# EAGLE design particle_photo_relay_board (EAGLE 9.1.2)
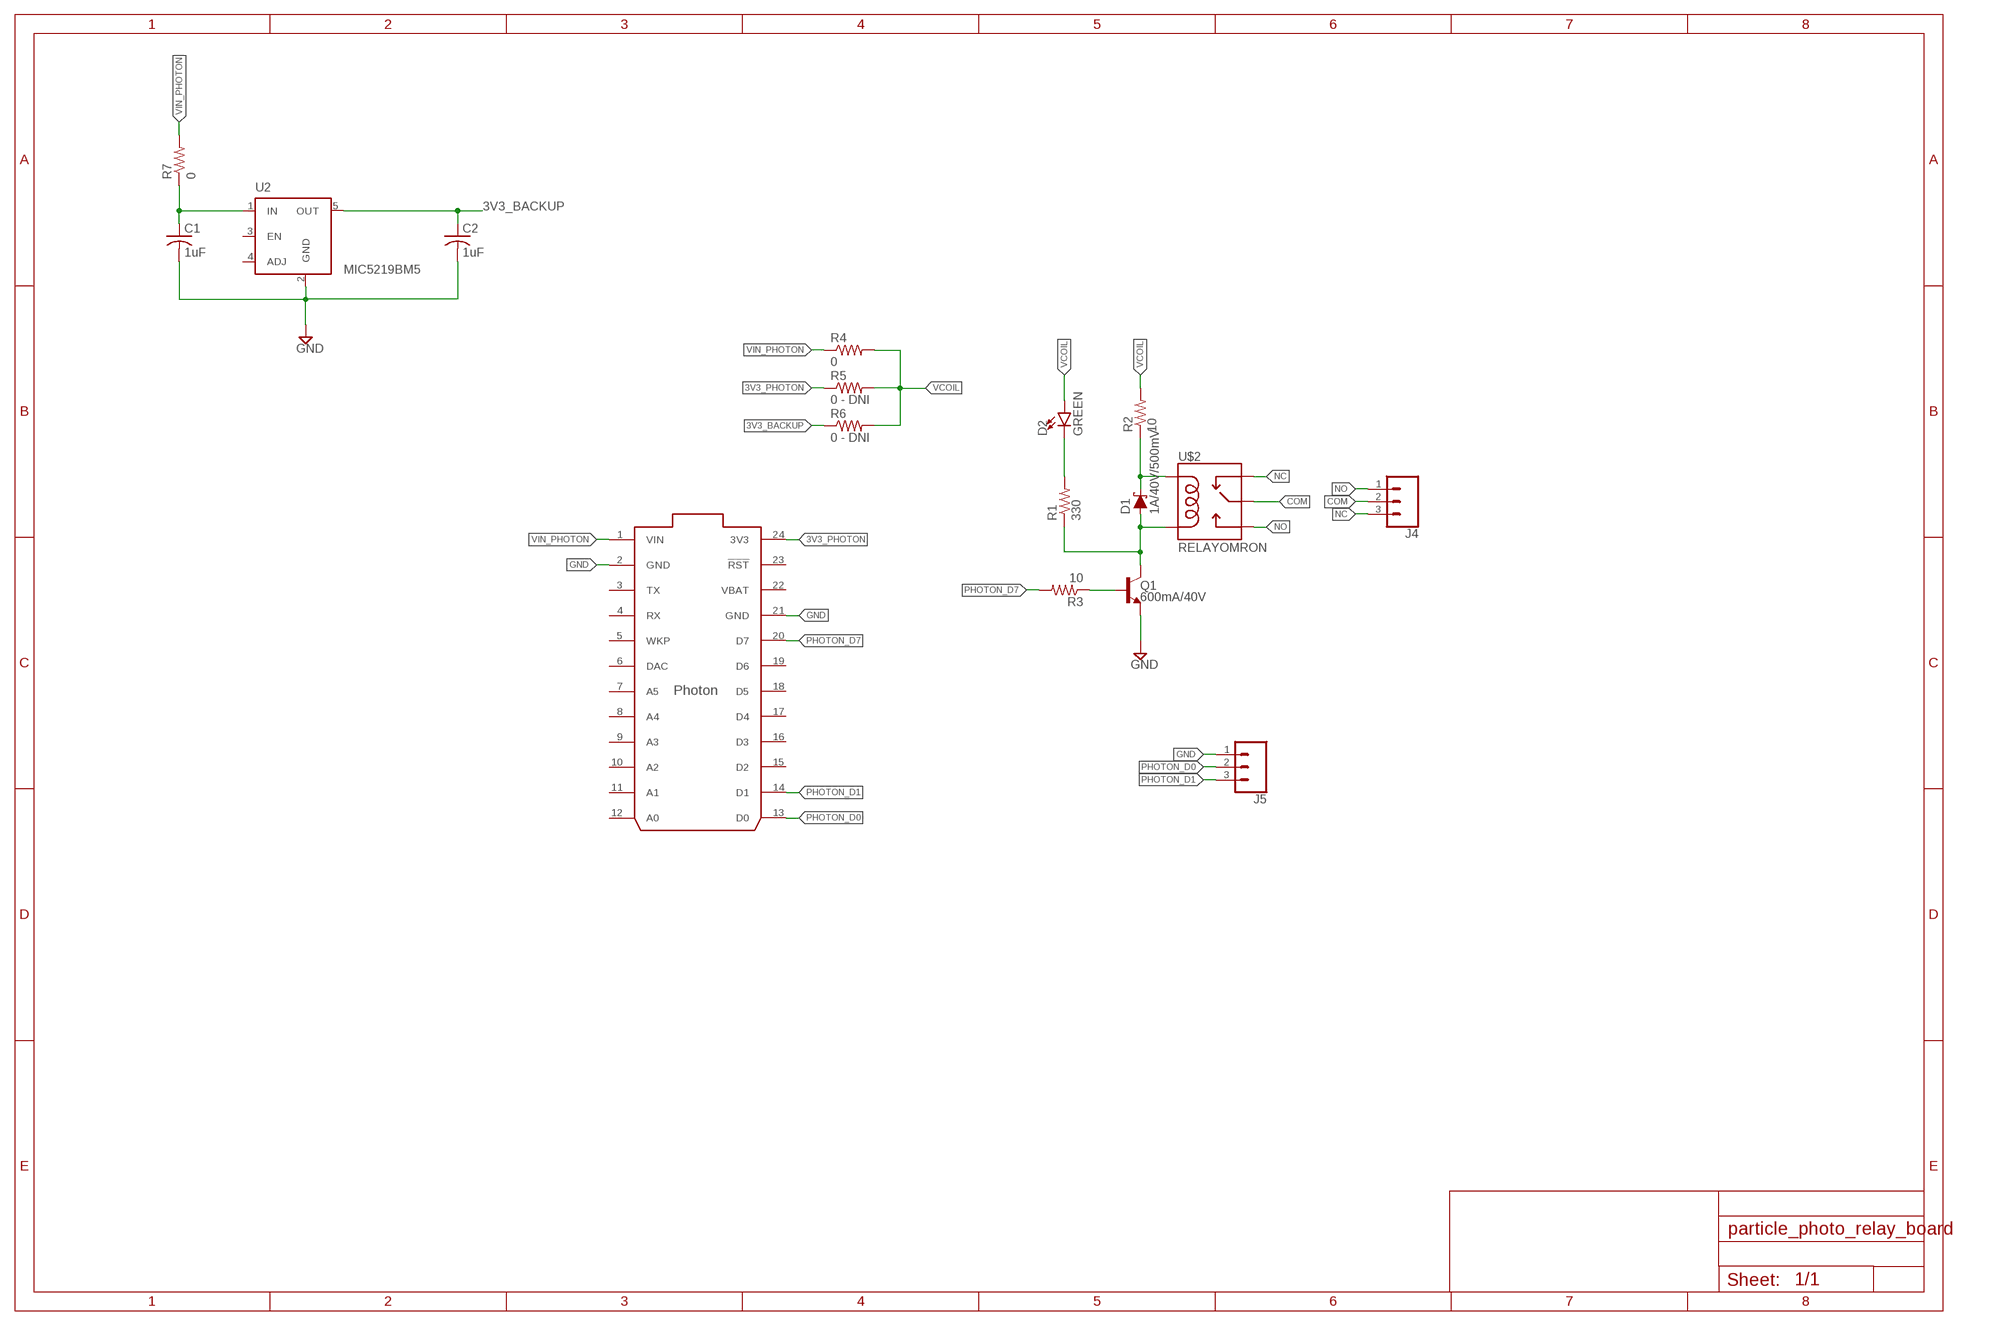
[diagram p0: schematic, sheet 1]

## Parts
C1  1uF  C-USC0805  [C0805]
C2  1uF  C-USC0805  [C0805]
D1  1A/40V/500mV  DIODE-SCHOTTKY-SS14  [SMA-DIODE]
D2  GREEN  LED-GREEN1206  [LED-1206]
J4  CONN_03-SCREW-5MM  [SCREWTERMINAL-5MM-3]
J5  CONN_03-SCREW-5MM  [SCREWTERMINAL-5MM-3]
Q1  600mA/40V  TRANS_NPN-MMBT2222AL  [SOT23-3]
R1  330  R-US_R0805  [R0805]
R2  10  R-US_R0805  [R0805]
R3  10  R-US_R0805  [R0805]
R4  0  R-US_R0805  [R0805]
R5  0 - DNI  R-US_R0805  [R0805]
R6  0 - DNI  R-US_R0805  [R0805]
R7  0  R-US_R0805  [R0805]
U2  MIC5219BM5  [SOT23-5]
U$1  PHOTON_WITH_HEADERS  [PHOTON]
U$2  RELAYOMRON  [G5LE-14-DC5]

## Nets
3V3_BACKUP: C2.1 R6.1 U2.5(OUT)
3V3_PHOTON: R5.1 U$1.24(3V3)
COM: J4.2 U$2.COMMON(MAIN)
GND: C1.2 C2.2 J5.1 Q1.2(E) U2.2(GND) U$1.2(GND) U$1.21(GND)
N$1: D1.A Q1.3(C) R1.1 U$2.COIL2
N$2: D1.C R2.1 U$2.COIL1
N$3: D2.C R1.2
N$4: Q1.1(B) R3.1
NC: J4.3 U$2.CLOSED(NC)
NO: J4.1 U$2.OPEN(NO)
PHOTON_D0: J5.2 U$1.13(D0)
PHOTON_D1: J5.3 U$1.14(D1)
PHOTON_D7: R3.2 U$1.20(D7)
VBUS_BACKUP: C1.1 R7.1 U2.1(IN)
VCOIL: D2.A R2.2 R4.2 R5.2 R6.2
VIN_PHOTON: R4.1 R7.2 U$1.1(VIN)
Unconnected: U2.3(EN) U2.4(ADJ) U$1.3(TX) U$1.4(RX) U$1.5(WKP) U$1.6(DAC) U$1.7(A5) U$1.8(A4) U$1.9(A3) U$1.10(A2) U$1.11(A1) U$1.12(A0) U$1.15(D2) U$1.16(D3) U$1.17(D4) U$1.18(D5) U$1.19(D6) U$1.23(!RST)

## Power pins joined to a net without a drawn wire
VBAT: U$1.22(VBAT)

## Library data of the parts
C1 C2 = rcl:C-US: CAPACITOR, American symbol; SPICEPREFIX: C
D1 = SparkFun-DiscreteSemi:DIODE-SCHOTTKY: Schottky diode A Schottky diode is a semiconductor diode which has a low forward voltage drop and a very fast switching action.; PROD_ID: DIO-08053
D2 = SparkFun-LED:LED-GREEN: Green SMD LED Used in manufacturing of various products at SparkFun Packages: 0603 - SMD 0603 package [Product Link] <http://www.futureelectronics.com/en/technologies/semiconductors/optoelectronics/leds/Pages/9894312-LTST-C190GKT.aspx?CrossPart=HSMG-C190&IM=0> LilyPad 1206 - SMD1206 LilyPad package [Product Link] <http://www.futureelectronics.com/en/Technologies/Product.aspx?ProductID=IN150NGHARVATEKCORPORATION2049943&IM=0> 1206 - SMD1206 package [Product Link] <http://www.futureelectronics.com/en/technologies/semiconductors/optoelectronics/leds/Pages/8315665-LTST-C150KGKT.aspx?IM=0> 1206 Bottom Mount -SMD 1206 Bottom Mount [Product Link] <http://www.digikey.com/product-detail/en/lite-on-inc/LTST-C230KGKT/160-1456-1-ND/386854> SparkFun Products: Pro Mini 328 -5V <https://www.sparkfun.com/products/821> RedBoard <https://www.sparkfun.com/products/12757> MP3 Trigger <https://www.sparkfun.com/products/13720> Makey Makey <https://www.sparkfun.com/products/11076>; PROD_ID: DIO-00862
J4 J5 = SparkFun-Connectors:CONN_03: Multi connection point. Often used as Generic Header-pin footprint for 0.1 inch spaced/style header connections On any of the 0.1 inch spaced packages, you can populate with these: Break Away Headers - Straight <https://www.sparkfun.com/products/116> (PRT-00116) Break Away Male Headers - Right Angle <https://www.sparkfun.com/products/553> (PRT-00553) Female Headers <https://www.sparkfun.com/products/115> (PRT-00115) Break Away Headers - Machine Pin <https://www.sparkfun.com/products/117> (PRT-00117) Break Away Female Headers - Swiss Machine Pin <https://www.sparkfun.com/products/743> (PRT-00743) Stackable Header - 3 Pin (Female, 0.1") <https://www.sparkfun.com/products/13875> (PRT-13875) For SCREWTERMINALS and SPRING TERMINALS visit here: Screw Terimnals on SparkFun.com <https://www.sparkfun.com/search/results?term=Screw+Terminals> (5mm/3.5mm/2.54mm spacing) This device is also useful as a general connection point to wire up your design to another part of your project. Our various solder wires solder well into these plated through hole pads. Hook-Up Wire - Assortment (Stranded, 22 AWG) <https://www.sparkfun.com/products/11375> (PRT-11375) Hook-Up Wire - Assortment (Solid Core, 22 AWG) <https://www.sparkfun.com/products/11367> (PRT-11367) View the entire wire category on our website here <https://www.sparkfun.com/categories/141> Special notes: Molex polarized connector foot print use with SKU : PRT-08232 with associated crimp pins and housings.; PROD_ID: CONN-10134; SF_SKU: PRT-08433
Q1 = SparkFun-DiscreteSemi:TRANS_NPN: NPN transistor Current controlled devices typically used to amplify current or used as a switch. BC547 - COM-08928 <http://www.sparkfun.com/products/8928> (TO-92 45V 100mA) (1.Collector 2.Base 3.Emitter) 2N3904 - COM-00521 <http://www.sparkfun.com/products/521> (TO-92 40V 200mA) (1.Emitter 2.Base 3.Collector) P2N2222A - COM-12852 <http://www.sparkfun.com/products/12852> (TO-92 40V 600mA) (1.Collector 2.Base 3.Emitter); PROD_ID: TRANS-08049
R1-R7 = rcl:R-US_: RESISTOR, American symbol; SPICEPREFIX: R
U2 = v-reg-micrel:MIC5219BM5: VOLTAGE REGULATOR; MF: ALTERA CORPORATION; MPN: MIC5219BM5 TR; OC_FARNELL: 1100656; OC_NEWARK: 09J8939
U$1 = Particle-Devices:PHOTON: Particle Photon Wi-Fi through-hole development board footprint Product datasheet: here <https://docs.particle.io/datasheets/photon-(wifi)/photon-datasheet/> Design files: here <https://github.com/particle-iot/photon> Github : Particle devices library <https://github.com/particle-iot/hardware-libraries/tree/master/Eagle>
U$2 = Particle:RELAY: SPDT relay (COM-00101)

## Board
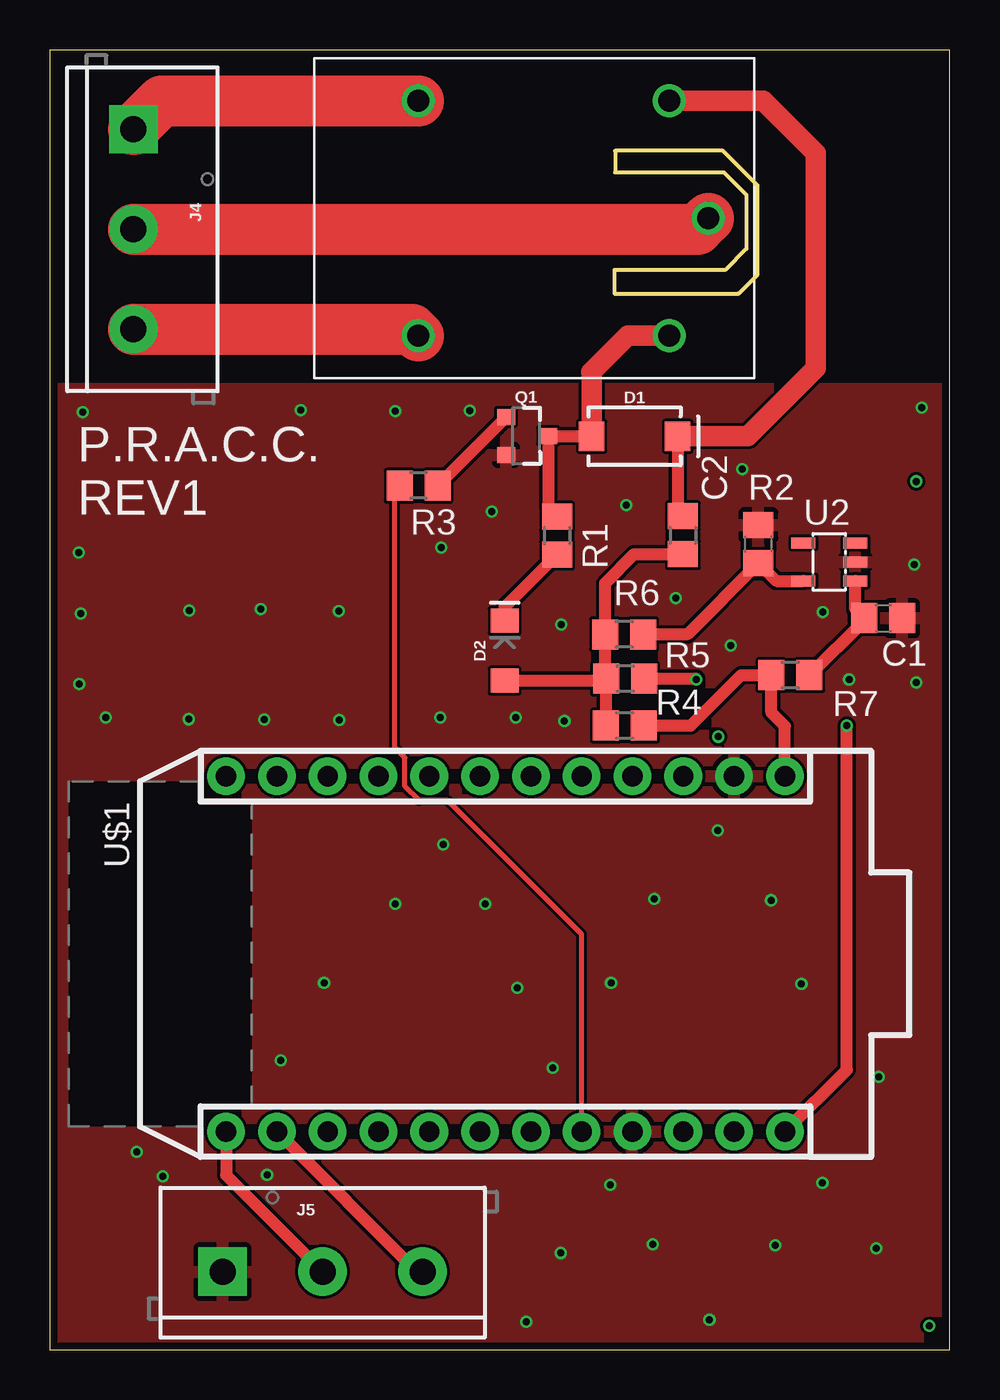
[diagram p1: board, top side]
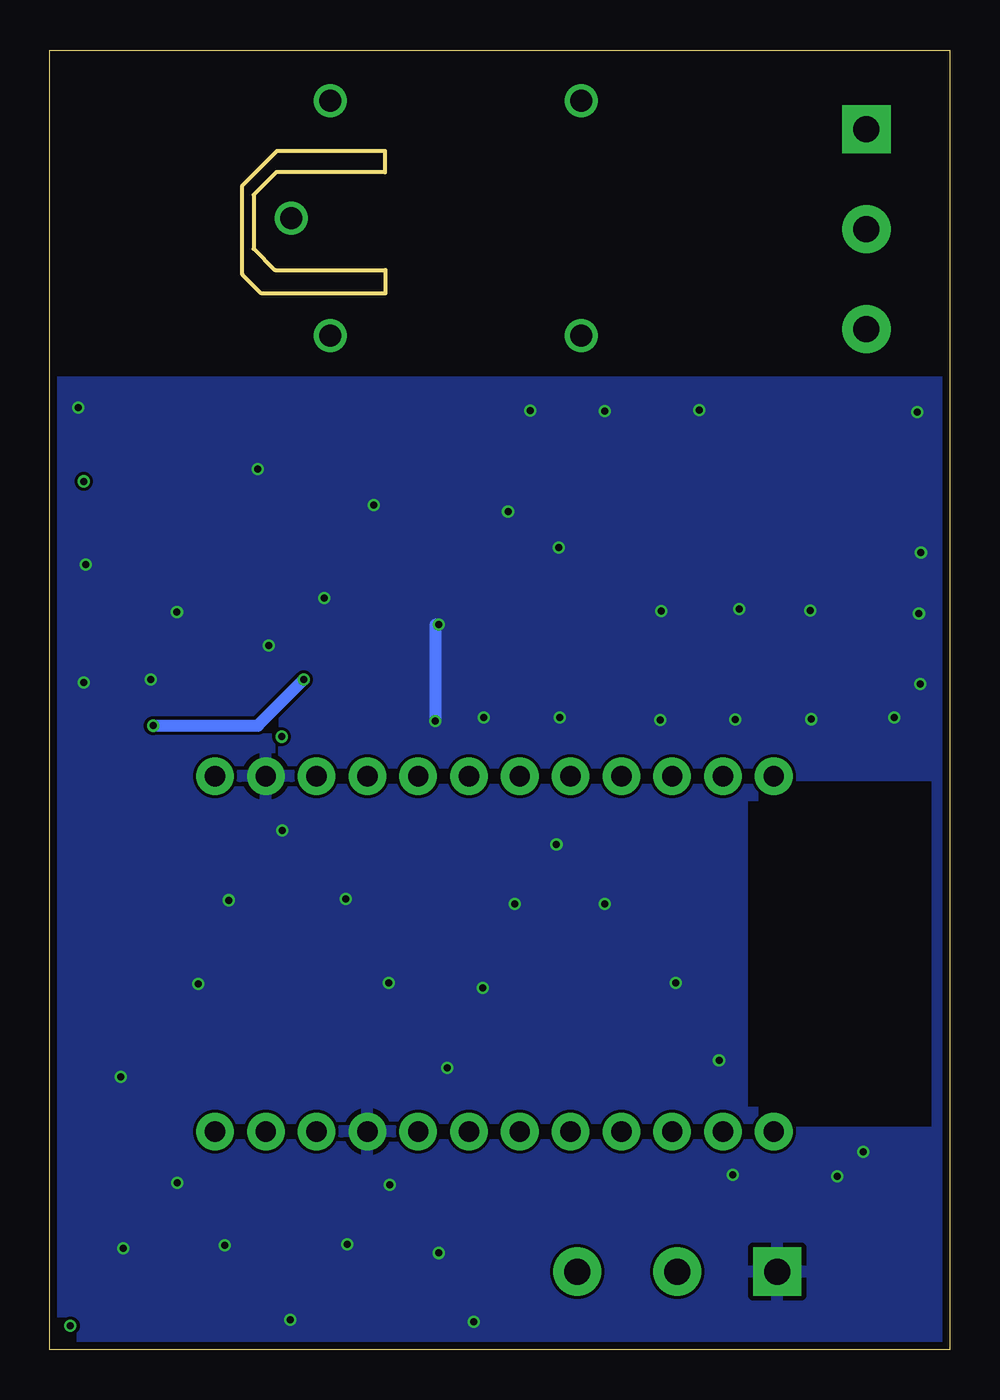
[diagram p2: board, bottom side, seen from below]

Size 45 x 65 mm. Coordinates in mm from the lower left corner, seen from the top.
Outline: 0,0 45,0 45,65 0,65 0,0
Copper layers (1*16): Top 0.035559375mm / dielectric 1.6mm / Bottom 0.035559375mm
Design rules "oshpark-2layer": minimum track width 6mil, minimum drill 10mil, track to track 6mil, track to pad 6mil, pad to pad 6mil, via to via 6mil, smd to smd 6mil, copper to edge 15mil, drill to drill 6mil, minimum pad ring 5mil, minimum via ring 5mil, stop-mask expansion 2.5mil, vias tented up to drill 0mil, thermal gap 10mil
Milling: area 28.2,52.8 to 35.4,60

### Footprints (pad centres in the part's own frame; a part is rotated, then mirrored left to right if it is on the bottom)
C0805 = smd 1.3 x 1.5: 1 -0.95,0; 2 0.95,0
SMA-DIODE = smd 1.27 x 1.47: A -2.15,0; C 2.15,0
LED-1206 = smd 1.2 x 1.4: A -1.5,0; C 1.5,0
SCREWTERMINAL-5MM-3 = drill 1.3 pad 2.413 square: 1 0,0 | drill 1.3 pad 2.413: 2 5,0; 3 10,0
SOT23-3 = smd 0.8 x 0.9: 1 -0.95,-1; 2 0.95,-1; 3 0,1.1
R0805 = smd 1.3 x 1.5: 1 -0.95,0; 2 0.95,0
SOT23-5 = smd 0.55 x 1.2: 1 -0.95,-1.3; 2 0,-1.3; 3 0.95,-1.3; 4 0.95,1.3; 5 -0.95,1.3
PHOTON = drill 1.016 pad 1.88: 1 1.27,33.02; 2 1.27,30.48; 3 1.27,27.94; 4 1.27,25.4; 5 1.27,22.86; 6 1.27,20.32; 7 1.27,17.78; 8 1.27,15.24; 9 1.27,12.7; 10 1.27,10.16; 11 1.27,7.62; 12 1.27,5.08; 13 19.05,5.08; 14 19.05,7.62; 15 19.05,10.16; 16 19.05,12.7; 17 19.05,15.24; 18 19.05,17.78; 19 19.05,20.32; 20 19.05,22.86; 21 19.05,25.4; 22 19.05,27.94; 23 19.05,30.48; 24 19.05,33.02
G5LE-14-DC5 = drill 1.1: CLOSED -6.275,-5.875; COIL1 6.275,5.875; COIL2 6.275,-5.875; COMMON 8.225,0; OPEN -6.275,5.875

### Placement (x,y rotation side)
C1  41.67,36.58 0 top
C2  35.43,40.29 90 top
D1  29.24,45.68 0 top
D2  22.74,34.96 90 top
J4  4.17,61.04 270 top
J5  8.63,3.9 0 top
Q1  23.81,45.71 270 top
R1  25.36,40.72 270 top
R2  31.65,40.73 270 top
R3  18.43,43.22 180 top
R4  28.75,31.21 180 top
R5  28.76,33.56 180 top
R6  28.71,35.78 180 top
R7  37.03,33.74 180 top
U2  38.97,39.4 90 top
U$1  3.73,29.95 270 top
U$2  24.7,56.59 0 top

### Tracks (layer width: path | path; a pad name or v marks a point on that pad's centre or on a via)
3V3_BACKUP
  Top 0.61: U2.5 36.32,38.45 C2.1 31.86,35.77 R6.1
3V3_PHOTON  (via drill 0.35)
  Top 0.61: U$1.24 39.84,14 v39.84,31.2 | R5.1 32.31,33.56 v32.31,33.51
  Bottom 0.61: v39.84,31.2 34.61,31.2 v32.31,33.51
COM
  Top 2.54: J4.2 32.37,56.04 U$2.COMMON
GND  (via drill 0.35)
  Bottom 0.61: v25.57,36.26 25.73,36.26 v25.73,31.44
  other vias: 43.59,47.12 1.45,39.86 1.63,46.9 14.43,36.94 12.54,46.99 1.55,36.82 1.47,33.28 17.26,46.95 20.99,46.97 22.1,41.91 19.57,40.12 28.81,42.24 34.61,44.05 43.21,39.27 34.05,35.22 19.51,31.61 23.3,31.61 14.47,31.48 10.72,31.53 6.93,31.53 2.78,31.61 41.33,5.07 38.63,8.34 36.26,5.2 32.98,1.49 30.14,5.27 28.01,8.25 25.55,4.83 10.85,8.75 5.64,8.67 4.33,9.9 43.32,33.37 39.96,33.51 38.65,36.9 31.29,37.59 23.81,1.38 10.54,37.05 6.97,36.97 11.54,14.46 13.7,18.34 17.26,22.29 19.67,25.27 21.77,22.29 23.36,18.09 25.13,14.08 28.05,18.34 30.21,22.54 33.39,25.97 36.06,22.48 37.58,18.28 41.45,13.64
  pour Bottom: -0.17,48.36 45.4,48.36 45.4,-0.18 -0.17,-0.18 -0.17,48.36
  pour Top: -0.16,48.06 45.4,48.06 45.4,-0.18 -0.16,-0.18
N$1
  Top 0.61: R1.1 24.91,42.12 Q1.3 24.93,45.68 D1.A
  Top 1.016: U$2.COIL2 28.89,50.72 27.06,48.89 27.09,48.87 D1.A
N$2
  Top 0.61: D1.C 31.39,41.95 R2.1
  Top 1.016: D1.C 34.89,45.68 38.3,49.09 38.3,59.84 35.67,62.47 U$2.COIL1
N$3
  Top 0.61: R1.2 22.74,37.14 D2.C
N$4
  Top 0.61: R3.1 22.81,46.65 Q1.1
N$33  (via drill 0.35)
  other vias: 33.42,30.66
N$37  (via drill 0.35)
  other vias: 43.31,43.43
N$38  (via drill 0.35)
  other vias: 43.98,1.18
NC
  Top 2.54: J4.3 18.1,51.04 U$2.CLOSED
NO
  Top 2.54: J4.1 5.6,62.47 U$2.OPEN
PHOTON_D0
  Top 0.61: U$1.13 8.81,8.72 J5.2
PHOTON_D1
  Top 0.61: U$1.14 18.35,3.9 J5.3
PHOTON_D7
  Top 0.254: U$1.20 26.59,20.77 19.89,27.46 18.46,27.46 17.75,28.18 17.75,29.61 17.24,30.12 17.24,42.97 R3.2
VBUS_BACKUP
  Top 0.61: R7.1 40.72,36.48 C1.1 40.27,37.03 U2.1
VCOIL
  Top 0.61: D2.A 27.72,33.46 R5.2 | R5.2 27.76,33.61 R6.2 27.76,38.33 29.21,39.78 R2.2 | R5.2 27.8,33.54 R4.2
VIN_PHOTON
  Top 0.61: U$1.1 36.75,31.19 36.08,31.86 R7.2 34.57,33.74 32.04,31.21 R4.1

### Text on the board
tNames: P.R.A.C.C. | REV1